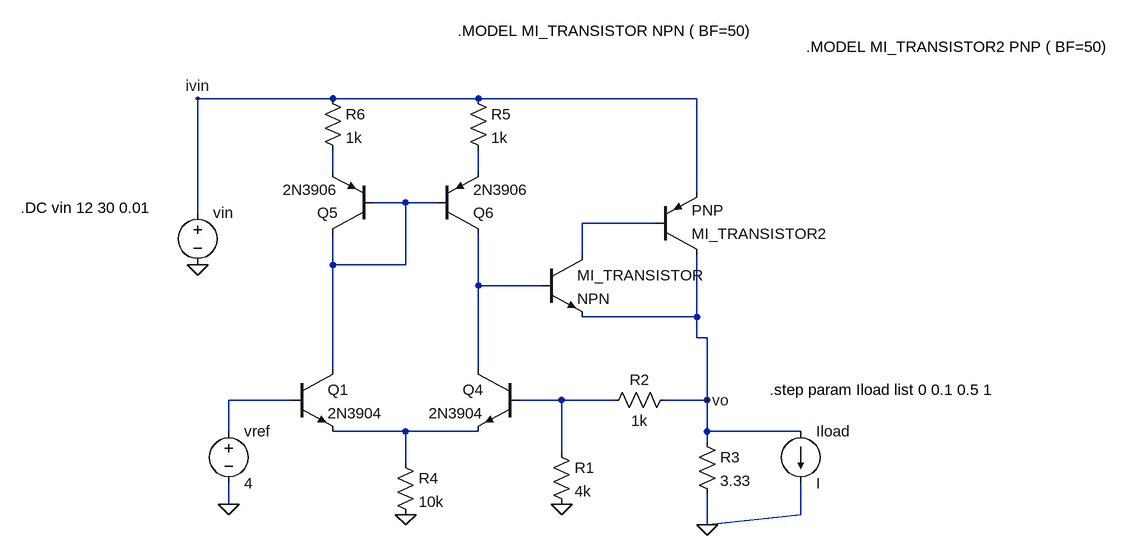
[diagram p0: schematic esquematico_circuitos2-regulacion_de_carga.asc]
esquematico_circuitos2-regulacion_de_carga.asc, the LTspice schematic file:
Version 4
SHEET 1 1532 680
WIRE -112 -400 -320 -400
WIRE 112 -400 -112 -400
WIRE 448 -400 112 -400
WIRE -112 -288 -112 -320
WIRE 112 -288 112 -320
WIRE 448 -256 448 -400
WIRE 0 -240 -48 -240
WIRE 48 -240 0 -240
WIRE -320 -224 -320 -400
WIRE 384 -208 272 -208
WIRE 272 -160 272 -208
WIRE -112 -144 -112 -192
WIRE 0 -144 0 -240
WIRE 0 -144 -112 -144
WIRE 112 -112 112 -192
WIRE 208 -112 112 -112
WIRE 448 -64 448 -160
WIRE 448 -64 272 -64
WIRE 448 -32 448 -64
WIRE 464 -32 448 -32
WIRE -112 16 -112 -144
WIRE 112 16 112 -112
WIRE -176 64 -272 64
WIRE 240 64 176 64
WIRE 320 64 240 64
WIRE 464 64 464 -32
WIRE 464 64 400 64
WIRE -272 112 -272 64
WIRE 0 112 -112 112
WIRE 112 112 0 112
WIRE 464 112 464 64
WIRE 608 112 464 112
WIRE 464 128 464 112
WIRE 240 144 240 64
WIRE 0 160 0 112
WIRE -272 224 -272 192
WIRE 608 240 608 192
WIRE 464 256 464 208
WIRE 464 256 608 240
FLAG 240 224 0
FLAG 464 256 0
FLAG 0 240 0
FLAG -272 224 0
FLAG -320 -144 0
FLAG 464 64 vo
FLAG -320 -400 ivin
SYMBOL res 224 128 R0
SYMATTR InstName R1
SYMATTR Value 4k
SYMBOL res 416 48 R90
WINDOW 0 0 56 VBottom 2
WINDOW 3 32 56 VTop 2
SYMATTR InstName R2
SYMATTR Value 1k
SYMBOL res 448 112 R0
SYMATTR InstName R3
SYMATTR Value 3.33
SYMBOL npn -176 16 R0
SYMATTR InstName Q1
SYMATTR Value 2N3904
SYMBOL npn 176 16 M0
SYMATTR InstName Q4
SYMATTR Value 2N3904
SYMBOL res -16 144 R0
SYMATTR InstName R4
SYMATTR Value 10k
SYMBOL pnp -48 -192 R180
SYMATTR InstName Q5
SYMATTR Value 2N3906
SYMBOL pnp 48 -192 M180
SYMATTR InstName Q6
SYMATTR Value 2N3906
SYMBOL res 96 -416 R0
SYMATTR InstName R5
SYMATTR Value 1k
SYMBOL res -128 -416 R0
SYMATTR InstName R6
SYMATTR Value 1k
SYMBOL voltage -272 96 R0
WINDOW 123 0 0 Left 0
WINDOW 39 0 0 Left 0
SYMATTR InstName vref
SYMATTR Value 4
SYMBOL voltage -320 -240 R0
WINDOW 3 24 44 Left 2
WINDOW 123 0 0 Left 0
WINDOW 39 0 0 Left 0
SYMATTR InstName vin
SYMATTR Value ""
SYMBOL npn 208 -160 R0
SYMATTR InstName MI_TRANSISTOR
SYMBOL pnp 384 -160 M180
SYMATTR InstName MI_TRANSISTOR2
SYMBOL current 608 112 R0
SYMATTR InstName Iload
TEXT 80 -504 Left 2 !.MODEL MI_TRANSISTOR NPN ( BF=50)
TEXT 616 -480 Left 2 !.MODEL MI_TRANSISTOR2 PNP ( BF=50)
TEXT -592 -232 Left 2 !.DC vin 12 30 0.01
TEXT 560 48 Left 2 !.step param Iload list 0 0.1 0.5 1

The netlist it stands for:
* esquematico_circuitos2-regulacion_de_carga.asc
R1 N007 0 4k
R2 vo N007 1k
R3 vo 0 3.33
Q1 N003 N006 N008 0 2N3904
Q4 N005 N007 N008 0 2N3904
R4 N008 0 10k
Q5 N003 N003 N001 0 2N3906
Q6 N005 N003 N002 0 2N3906
R5 ivin N002 1k
R6 ivin N001 1k
vref N006 0 4
vin ivin 0
Q§MI_TRANSISTOR N004 N005 vo 0 NPN
Q§MI_TRANSISTOR2 vo N004 ivin 0 PNP
Iload vo 0 I
.model NPN NPN
.model PNP PNP
.lib standard.bjt
.MODEL MI_TRANSISTOR NPN ( BF=50)
.MODEL MI_TRANSISTOR2 PNP ( BF=50)
.DC vin 12 30 0.01
.step param Iload list 0 0.1 0.5 1
.backanno
.end